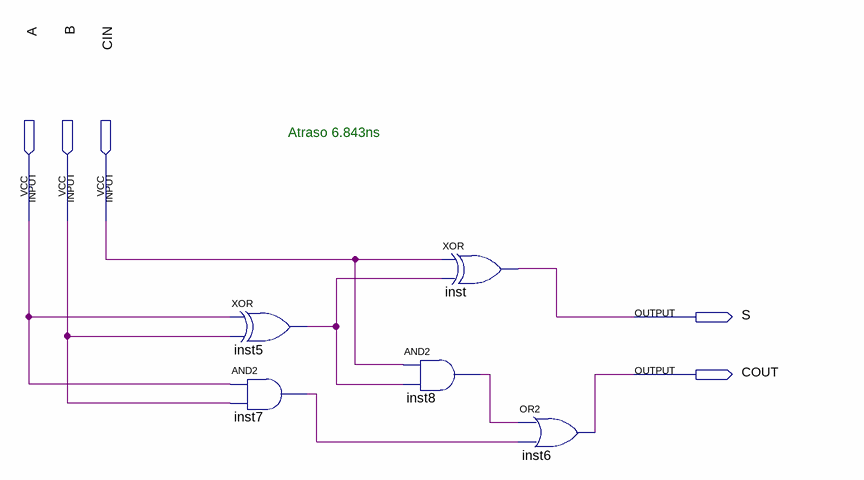
[diagram p0: schematic sheet]
// Quartus schematic FULL_ADDER_1BIT.bdf as structural Verilog: 5 symbols, 5 pins
module FULL_ADDER_1BIT (
  input  A,
  input  B,
  input  CIN,
  output S,
  output COUT
);

  wire inst5_out, inst7_out, inst8_out;

  xor inst5 (inst5_out, A, B);
  and inst7 (inst7_out, A, B);
  and inst8 (inst8_out, CIN, inst5_out);
  xor inst (S, CIN, inst5_out);
  or inst6 (COUT, inst8_out, inst7_out);

  // Notes on the sheet:
  //   Atraso 6.843ns
endmodule
